# Altium schematic sheet [3]Codec.SchDoc
size A4; SheetNumber: 3; SheetTotal: 5
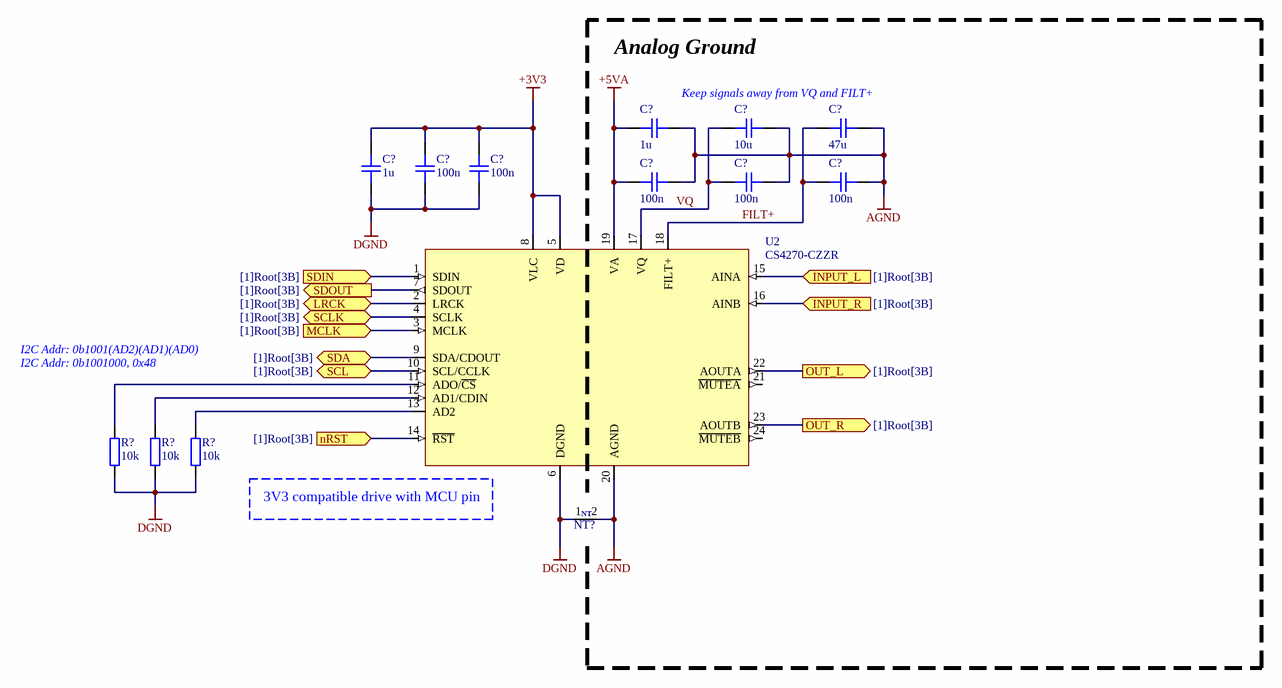
[diagram p0: [3]Codec.SchDoc]

## Parts
(Parts that share a designator on the sheet are numbered #1, #2 ... from top to bottom, then left to right.)
C?#1  1u  [CAP_0603]
C?#2  10u  [CAP_1210]
C?#3  47u  [CAP_1210]
C?#4  1u  [CAP_0603]
C?#5  100n  [CAP_0603]
C?#6  100n  [CAP_0603]
C?#7  100n  [CAP_0603]
C?#8  100n  [CAP_0603]
C?#9  100n  [CAP_0603]
NT?  NT  [NETTIE]  (value not drawn)  (net tie, no BOM)
R?#1  10k  [RES_0402]
R?#2  10k  [RES_0402]
R?#3  10k  [RES_0402]
U2  CS4270-CZZR  [TSSOP-24]

## Ports
INPUT_L (in, see [1]Root[3B]), INPUT_R (in, see [1]Root[3B]), LRCK (bidir, see [1]Root[3B]), MCLK (in, see [1]Root[3B]), nRST (in, see [1]Root[3B]), OUT_L (out, see [1]Root[3B]), OUT_R (out, see [1]Root[3B]), SCL (bidir, see [1]Root[3B]), SCLK (bidir, see [1]Root[3B]), SDA (bidir, see [1]Root[3B]), SDIN (in, see [1]Root[3B]), SDOUT (out, see [1]Root[3B])

## Nets
+3V3: C?#4.2 C?#5.1 C?#6.1 U2.5(VD) U2.8(VLC)
+5VA: C?#1.1 C?#7.2 U2.19(VA)
AGND: C?#1.2 C?#2.2 C?#3.2 C?#7.1 C?#8.2 C?#9.2 NT?.2 U2.20(AGND)
DGND: C?#4.1 C?#5.2 C?#6.2 NT?.1 R?#1.1 R?#2.1 R?#3.1 U2.6(DGND)
FILT+: C?#3.1 C?#9.1 U2.18(FILT+)
INPUT_L: U2.15(AINA) ; port INPUT_L
INPUT_R: U2.16(AINB) ; port INPUT_R
LRCK: U2.2(LRCK) ; port LRCK
MCLK: U2.3(MCLK) ; port MCLK
nRST: U2.14(~{RST}) ; port nRST
OUT_L: U2.22(AOUTA) ; port OUT_L
OUT_R: U2.23(AOUTB) ; port OUT_R
SCL: U2.10(SCL/CCLK) ; port SCL
SCLK: U2.4(SCLK) ; port SCLK
SDA: U2.9(SDA/CDOUT) ; port SDA
SDIN: U2.1(SDIN) ; port SDIN
SDOUT: U2.7(SDOUT) ; port SDOUT
VQ: C?#2.1 C?#8.1 U2.17(VQ)
NetR?#1_2: R?#1.2 U2.11(ADO/~{CS})
NetR?#2_2: R?#2.2 U2.12(AD1/CDIN)
NetR?#3_2: R?#3.2 U2.13(AD2)

Not connected (* = marked no-connect by the designer): U2 21(~{MUTEA}) 24(~{MUTEB})

## Notes on the sheet
- Analog Ground
- (near C?#2) Keep signals away from VQ and FILT+
- I2C Addr: 0b1001(AD2)(AD1)(AD0)
- I2C Addr: 0b1001000, 0x48
- (near U2) 3V3 compatible drive with MCU pin

## Library data of the parts
C?#1 C?#4-C?#9 = CAP_0603: Capacitor SMD 0603; Manufacturer: *; Manufacturer Part Number: *; Distributor Link: *; LCSC: *; Rating: *; Dielectric: *
C?#2 C?#3 = CAP_1210: Capacitor SMD 1210; Manufacturer: *; Manufacturer Part Number: *; Distributor Link: *; LCSC: *; Rating: *; Dielectric: *
NT? = NetTie: Net Tie
R?#1-R?#3 = RES_0402: Resistor SMD 0402; Manufacturer: *; Manufacturer Part Number: *; Distributor Link: *; LCSC: *
U2 = CS4270-CZZR: 24-Bit 192kHz Stereo Audio Codec TSSOP-24; Manufacturer: Cirrus Logic; Manufacturer Part Number: CS4270-CZZR